# EAGLE design MouseGoggles IRLED-1-5 (EAGLE 9.6.2)
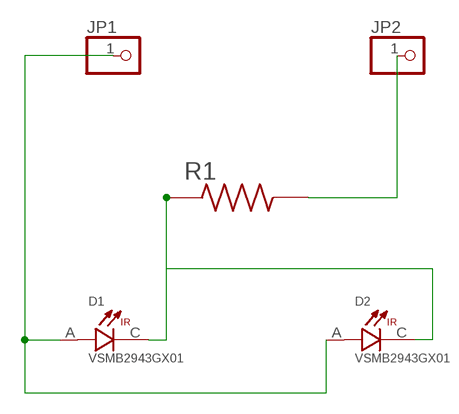
[diagram p0: schematic, sheet 1]

## Parts
D1  VSMB2943GX01  [DIO_VSMB2943GX01]
D2  VSMB2943GX01  [DIO_VSMB2943GX01]
JP1  PINHD-1X1  [1X01]
JP2  PINHD-1X1  [1X01]
R1  RC0805FR-07100RL  [RESC2012X60N]

## Nets
N$1: JP2.1 R1.2
N$2: D1.A D2.A JP1.1
N$4: D1.C D2.C R1.1

## Library data of the parts
D1 D2 = VSMB2943GX01:VSMB2943GX01: Infrared Emitter 940nm 20mW/sr Circular Top Mount Automotive 2-Pin SMD T/R; MANUFACTURER: VISHAY; MAXIMUM_PACKAGE_HEIGHT: 2.7mm; PARTREV: 1.6; STANDARD: Manufacturer recommendations
JP1 JP2 = pinhead:PINHD-1X1: PIN HEADER
R1 = RC0805FR-07100RL:RC0805FR-07100RL: Resistor SMD [YAGEO] RC0805FR-07100RL Resistor SMD

## Board
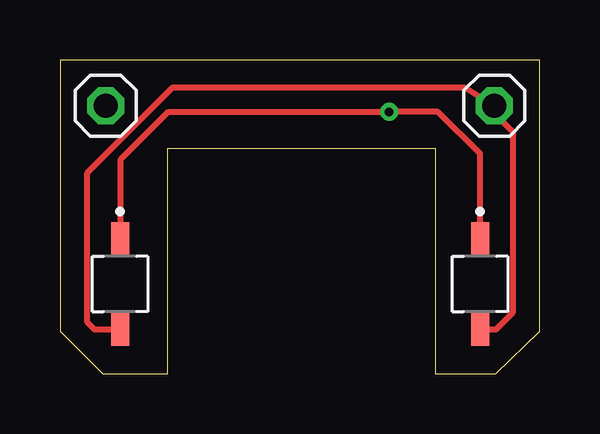
[diagram p1: board, top side]
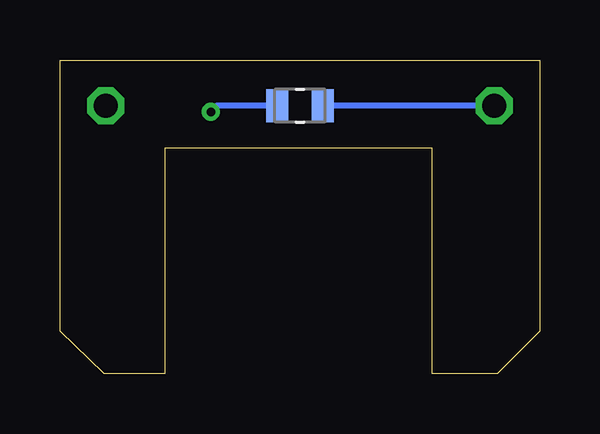
[diagram p2: board, bottom side, seen from below]

Size 20 x 13.08 mm. Coordinates in mm from the lower left corner, seen from the top.
Outline: 0,1.78 1.78,0 4.48,0 4.48,9.4 15.63,9.4 15.63,0 18.16,0 20,1.78 20,13.08 0,13.08 0,1.78
Copper layers (1*16): Top 0.035mm / dielectric 1.5mm / Bottom 0.035mm
Design rules "default *": minimum track width 6mil, minimum drill 0.35mm, track to track 6mil, track to pad 6mil, pad to pad 6mil, via to via 6mil, smd to smd 6mil, copper to edge 40mil, drill to drill 12mil, minimum pad ring 10mil, minimum via ring 8mil, stop-mask expansion 4mil, vias tented up to drill 0mil, thermal gap 10mil

### Footprints (pad centres in the part's own frame; a part is rotated, then mirrored left to right if it is on the bottom)
DIO_VSMB2943GX01 = smd 1.35 x 0.75: A 1.9,0; C -1.9,0
1X01 = drill 1.016 octagon: 1 0,0
RESC2012X60N = smd 0.92 x 1.38: 1 -0.955,0; 2 0.955,0

### Placement (x,y rotation side)
D1  2.5,3.75 270 top
D2  17.5,3.75 270 top
JP1  18.09,11.18 0 top
JP2  1.91,11.18 0 top
R1  10,11.18 0 bottom

### Tracks (layer width: path | path; a pad name or v marks a point on that pad's centre or on a via)
N$1
  Bottom 0.254: JP2.1 R1.2
N$2
  Top 0.254: D2.A 18.16,1.85 18.86,2.54 18.86,10.1 18.29,10.67 JP1.1 16.86,11.94 4.7,11.94 1.14,8.38 1.14,2.16 1.46,1.85 D1.A
N$4  (via drill 0.35)
  Top 0.254: D1.C 2.54,5.69 2.54,8.95 4.51,10.92 v13.72,10.92 15.75,10.92 17.5,9.17 D2.C
  Bottom 0.254: R1.1 13.46,11.18 v13.72,10.92